# Altium project Modelo levitador magnético.PrjPcb
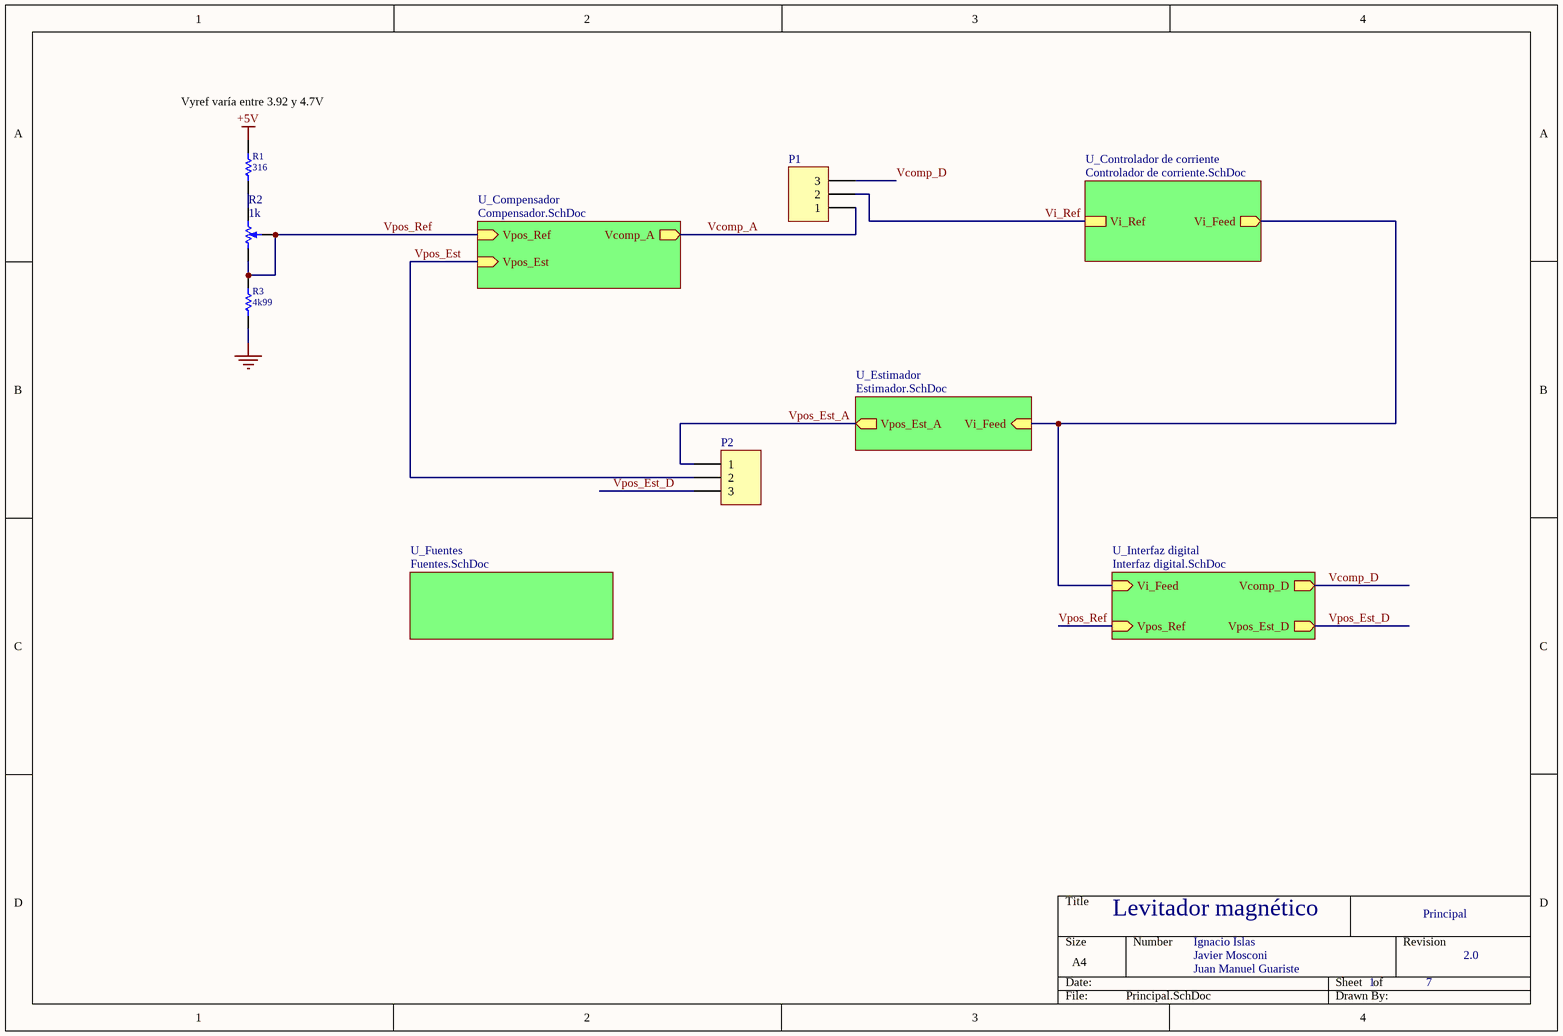
[diagram p0: Principal.SchDoc]
7 sheets, 249 parts. Net scope: hierarchical (ports join the sheet entries above them; power ports are global).
Board file: Levitador Magnetico.PcbDoc
Sheets:
  Principal.SchDoc
    U_Estimador = Estimador.SchDoc
    U_Compensador = Compensador.SchDoc
    U_Fuentes = Fuentes.SchDoc
    U_Interfaz digital = Interfaz digital.SchDoc
    U_Controlador de corriente = Controlador de corriente.SchDoc
      U_Puente H = Puente H.SchDoc

## Sheet Principal.SchDoc: Levitador magnético
size A4; Date: 27/10/2020; DocumentNumber: 1; SheetNumber: 1; SheetTotal: 7

### Parts
P1  Header 3  [HDR1X3]  (value not drawn)
P2  Header 3  [HDR1X3]  (value not drawn)
R1  316  [R1206]
R2  value 1k  [pote_5_pines_vertical]  (hidden comment: Potenciometro)
R3  4k99  [R1206]

### Sub-sheets
U_Compensador = Compensador.SchDoc: Vcomp_A (out), Vpos_Est (in), Vpos_Ref (in)
U_Controlador de corriente = Controlador de corriente.SchDoc: Vi_Ref, Vi_Feed (out)
U_Estimador = Estimador.SchDoc: Vi_Feed (in), Vpos_Est_A (out)
U_Fuentes = Fuentes.SchDoc: no entries
U_Interfaz digital = Interfaz digital.SchDoc: Vi_Feed (in), Vpos_Ref (in), Vcomp_D (out), Vpos_Est_D (out)

### Nets
+5V: R1.2
GND: R3.1
Vcomp_A: P1.1 ; sheet U_Compensador/Vcomp_A
Vcomp_D: P1.3 ; sheet U_Interfaz digital/Vcomp_D
Vi_Feed: sheet U_Estimador/Vi_Feed, sheet U_Interfaz digital/Vi_Feed, sheet U_Controlador de corriente/Vi_Feed
Vi_Ref: P1.2 ; sheet U_Controlador de corriente/Vi_Ref
Vpos_Est: P2.2 ; sheet U_Compensador/Vpos_Est
Vpos_Est_A: P2.1 ; sheet U_Estimador/Vpos_Est_A
Vpos_Est_D: P2.3 ; sheet U_Interfaz digital/Vpos_Est_D
Vpos_Ref: R2.2(W) R2.3(-) R3.2 ; sheet U_Compensador/Vpos_Ref, sheet U_Interfaz digital/Vpos_Ref
NetR1_1: R1.1 R2.1(+)

### Notes on the sheet
- (near R1) Vyref varía entre 3.92 y 4.7V
- Principal
- Ignacio Islas
- Javier Mosconi
- Juan Manuel Guariste
- 2.0

### Library data of the parts
P1 P2 = Header 3: TERM BLK 3P SIDE ENT 2.54MM PCB; Manufacturer: TE Connectivity AMP Connectors; Mfr PN: 282834-3; Class: Connector; Link: https://www.digikey.com/en/products/detail/te-connectivity-amp-connectors/282834-3/1153264; Supplier 1 PN: A98334-ND; Supplier 1: Digi-Key; Supplier 2: Mouser; Supplier 2 PN: 571-2828343
R1 = R1206: RES 316 OHM 1% 1/4W 1206; Manufacturer: Stackpole Electronics Inc; Mfr PN: RMCF1206FT316R; LatestRevisionDate: 29/7/2021; PackageReference: 1206; PackageDescription: SMT Chip Resistor; Supplier 1: Digi-Key; Value: 316; Tolerance: 1%; Supplier 1 PN: RMCF1206FT316RCT-ND
R2 = Potenciometro: POT 1K OHM 0.08W CARBON LINEAR; Manufacturer: Bourns Inc.; Mfr PN: PDB12-H4251-102BF; Supplier 1: Digi-Key; Supplier 1 PN: PDB12-H4251-102BF-ND
R3 = R1206: RES 4.99K OHM 1% 1/4W 1206; Manufacturer: Stackpole Electronics Inc; Mfr PN: RMCF1206FT4K99; LatestRevisionDate: 29/7/2021; PackageReference: 1206; PackageDescription: SMT Chip Resistor; Supplier 1: Digi-Key; Value: 4k99; Tolerance: 1%; Supplier 1 PN: RMCF1206FT4K99CT-ND

## Sheet Estimador.SchDoc
size A4; DocumentNumber: 5; SheetNumber: 5; SheetTotal: 7
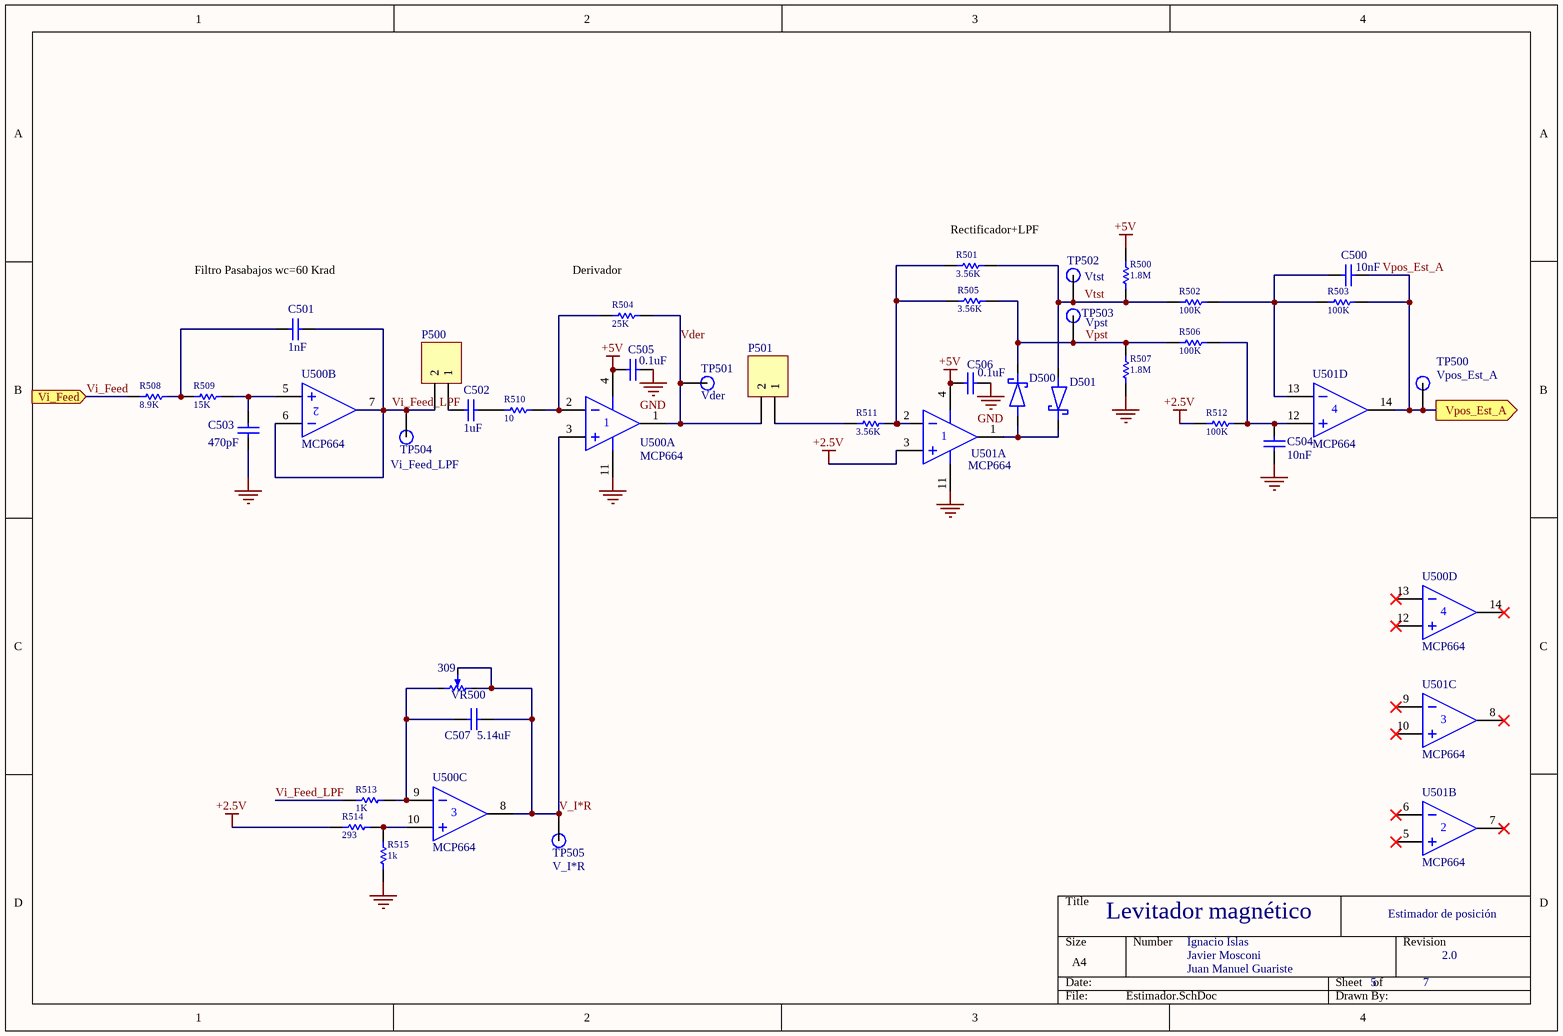
[diagram p1: Estimador.SchDoc]

### Parts
C500  value 10nF  [C1206]  (hidden comment: Capacitor)
C501  value 1nF  [C1206]  (hidden comment: Capacitor)
C502  value 1uF  [C1206]  (hidden comment: Capacitor)
C503  value 470pF  [C1206]  (hidden comment: Capacitor)
C504  value 10nF  [C1206]  (hidden comment: Capacitor)
C505  value 0.1uF  [C1206]  (hidden comment: Capacitor)
C506  value 0.1uF  [C1206]  (hidden comment: Capacitor)
C507  value 5.14uF  [C1206]  (hidden comment: Capacitor)
D500  RSX205LAM30TR  [SODFL4725X105N]  (value not drawn)
D501  RSX205LAM30TR  [SODFL4725X105N]  (value not drawn)
P500  Header 2  [HDR1X2]  (value not drawn)
P501  Header 2  [HDR1X2]  (value not drawn)
R500  1.8M  [R1206]
R501  3.56K  [R1206]
R502  100K  [R1206]
R503  100K  [R1206]
R504  25K  [R1206]
R505  3.56K  [R1206]
R506  100K  [R1206]
R507  1.8M  [R1206]
R508  8.9K  [R1206]
R509  15K  [R1206]
R510  10  [R1206]
R511  3.56K  [R1206]
R512  100K  [R1206]
R513  1K  [R1206]
R514  293  [R1206]
R515  1k  [R1206]
TP500  Vpos_Est_A  [TestPoint Keystone 5000 Silver-Red]
TP501  Vder  [TestPoint Keystone 5000 Silver-Red]
TP502  Vtst  [TestPoint Keystone 5000 Silver-Red]
TP503  Vpst  [TestPoint Keystone 5000 Silver-Red]
TP504  Vi_Feed_LPF  [TestPoint Keystone 5000 Silver-Red]
TP505  V_I*R  [TestPoint Keystone 5000 Silver-Red]
U500  MCP664  [SOIC14]  (parts A,B,C,D of 4)
U501  MCP664  [SOIC14]  (parts A,B,C,D of 4)
VR500  value 309  [3299Y1203LF]  (hidden comment: Trimmer (Thru-Hole))

### Ports
Vi_Feed (in), Vpos_Est_A (out)

### Nets
+2.5V: R512.2 R514.1 U501.3(IN+)
+5V: C505.1 C506.1 R500.2 U500.4(V+) U501.4(V+)
GND: C503.2 C504.1 C505.2 C506.2 R507.1 R515.1 U500.11(V-) U501.11(V-)
V_I*R: C507.1 TP505.1 U500.3(IN+) U500.8(OUT) VR500.2(W) VR500.3(CW)
Vder: P501.2 R504.2 TP501.1 U500.1(OUT)
Vi_Feed: R508.1 ; port Vi_Feed
Vi_Feed_LPF: C501.1 P500.2 R513.1 TP504.1 U500.6(IN-) U500.7(OUT)
Vpos_Est_A: C500.1 R503.1 TP500.1 U501.14(OUT) ; port Vpos_Est_A
Vpst: D500.1(K) R505.2 R506.1 R507.2 TP503.1
Vtst: D501.2(A) R500.1 R501.2 R502.1 TP502.1
NetC500_2: C500.2 R502.2 R503.2 U501.13(IN-)
NetC501_2: C501.2 R508.2 R509.1
NetC502_1: C502.1 P500.1
NetC502_2: C502.2 R510.1
NetC503_1: C503.1 R509.2 U500.5(IN+)
NetC504_2: C504.2 R506.2 R512.1 U501.12(IN+)
NetC507_2: C507.2 R513.2 U500.9(IN-) VR500.1(CCW)
NetD500_2: D500.2(A) D501.1(K) U501.1(OUT)
NetP501_1: P501.1 R511.1
NetR501_1: R501.1 R505.1 R511.2 U501.2(IN-)
NetR504_1: R504.1 R510.2 U500.2(IN-)
NetR514_2: R514.2 R515.2 U500.10(IN+)

Not connected (* = marked no-connect by the designer): U500 12(IN+)* 13(IN-)* 14(OUT)*; U501 5(IN+)* 6(IN-)* 7(OUT)* 8(OUT)* 9(IN-)* 10(IN+)*

### Notes on the sheet
- (near R501) Rectificador+LPF
- (near C501) Filtro Pasabajos wc=60 Krad
- (near R504) Derivador
- Levitador magnético
- Estimador de posición
- Ignacio Islas
- Javier Mosconi
- Juan Manuel Guariste
- 2.0

### Library data of the parts
C500 C504 = Capacitor: CAP CER 10000PF 500V X7R 1206; Manufacturer: KEMET; Mfr PN: C1206C103KCRAC7800; Supplier 1: Digi-Key; Supplier 1 PN: 399-C1206C103KCRAC7800CT-ND
C501 = Capacitor: CAP CER 1000PF 2KV X7R 1206; Mfr PN: 202R18W102KV4E; Manufacturer: Johanson Dielectrics Inc.; Supplier 1: Digi-Key; Supplier 1 PN: 709-1036-1-ND
C502 = Capacitor: CAP CER 1UF 25V X7R 1206; Manufacturer: CAL-CHIP ELECTRONICS, INC.; Mfr PN: GMC31X7R105M25NT; Supplier 1: Digi-Key; Supplier 1 PN: 2571-GMC31X7R105M25NTTR-ND
C503 = Capacitor: CAP CER 470PF 1KV C0G/NP0 1206; Manufacturer: Samsung Electro-Mechanics; Mfr PN: CL31C471JIHNNNE; Supplier 1: Digi-Key; Supplier 1 PN: 1276-3279-1-ND
C505 C506 = Capacitor: CAP CER 0.1UF 50V X7R 1206; Mfr PN: C1206X7R500-104KNE; Manufacturer: Venkel; Supplier 1: Digi-Key; Supplier 1 PN: 2679-C1206X7R500-104KNETR-ND
C507 = Capacitor: CAP CER 5100PF 100V NP0 5% 1206; Mfr PN: C1206C512J1GAC7800; Manufacturer: KEMET; Supplier 1: Digi-Key; Supplier 1 PN: 399-16393-1-ND
D500 D501 = RSX205LAM30TR: DIODE SCHOTTKY 30V 2A PMDTM; Manufacturer: ROHM Semiconductor; Mfr PN: RSX205LAM30TR; Supplier 1: Digi-Key; Supplier 1 PN: RSX205LAM30CT-ND
P500 P501 = Header 2: TERM BLK 2P SIDE ENT 2.54MM PCB; Manufacturer: TE Connectivity AMP Connectors; Mfr PN: 282834-2; Link: https://www.digikey.com/en/products/detail/te-connectivity-amp-connectors/282834-2/1150135; Supplier 1: Digi-Key; Supplier 1 PN: A98333-ND
R500 R507 = R1206: RES 1.8M OHM 1% 1/4W 1206; Mfr PN: RC1206FR-071M8L; Manufacturer: YAGEO; Supplier 1 PN: 311-1.80MFRCT-ND; Supplier 1: Digi-Key; Value: 1.8M; Tolerance: 1%
R501 R505 R511 = R1206: RES 3.57K OHM 1% 1/4W 1206; Mfr PN: RC1206FR-073K57L; Manufacturer: YAGEO; Supplier 1 PN: 311-3.57KFRCT-ND; Supplier 1: Digi-Key; Value: 3.56K; Tolerance: 1%
R502 R503 R506 R512 = R1206: RES 100K OHM 1% 1/4W 1206; Mfr PN: RMCF1206FT100K; Manufacturer: Stackpole Electronics Inc; Supplier 1 PN: RMCF1206FT100KCT-ND; Supplier 1: Digi-Key; Value: 100K; Tolerance: 1%
R504 = R1206: RES SMD 25K OHM 1% 1/4W 1206; Mfr PN: Y163025K0000F0W; Manufacturer: Vishay Foil Resistors (Division of Vishay Precision Group); PackageReference: 1206; Supplier 1 PN: Y163025K0000F0W-ND; Supplier 1: Digi-Key; Value: 25K; Tolerance: 1%
R508 = R1206: RES 8.87K OHM 1% 1/4W 1206; Mfr PN: RC1206FR-078K87L; Manufacturer: YAGEO; PackageReference: 1206; Supplier 1 PN: 311-8.87KFRCT-ND; Supplier 1: Digi-Key; Value: 8.9K; Tolerance: 1%
R509 = R1206: RES 15K OHM 1% 1/4W 1206; Mfr PN: CRCW120615K0FKEAC; Manufacturer: Vishay Dale; Supplier 1 PN: 541-CRCW120615K0FKEACCT-ND; PackageReference: 1206; Supplier 1: Digi-Key; Value: 15K; Tolerance: 1%
R510 = R1206: RES 10 OHM 1% 1/4W 1206; Mfr PN: RMCF1206FT10R0; Manufacturer: Stackpole Electronics Inc; Supplier 1 PN: RMCF1206FT10R0CT-ND; Supplier 1: Digi-Key; Value: 10; Tolerance: 1%
R513 R515 = R1206: RES 1K OHM 1% 1/4W 1206; Mfr PN: RMCF1206FT1K00; Manufacturer: Stackpole Electronics Inc; Supplier 1 PN: RMCF1206FT1K00CT-ND; Supplier 1: Digi-Key; Tolerance: 1%
  R513: Value: 1K
  R515: Value: 1k
R514 = R1206: RES SMD 294 OHM 1% 1/4W 1206; Mfr PN: CRCW1206294RFKEA; Manufacturer: Vishay Dale; Supplier 1 PN: 541-294FCT-ND; Supplier 1: Digi-Key; Tolerance: 1%; Value: 293
TP500-TP505 = Testpoint: PC TEST POINT MINIATURE RED; Manufacturer: Keystone Electronics; Mfr PN: 5000; Link: https://www.digikey.com/en/products/detail/keystone-electronics/5000/255326; Supplier 1: Digi-Key; Supplier 1 PN: 36-5000-ND
U500 U501 = MCP664: IC OPAMP GP 4 CIRCUIT 14TSSOP; Mfr PN: MCP664-E/ST; Manufacturer: Microchip Technology; Datasheet: https://ar.mouser.com/datasheet/2/268/20002194E-2448650.pdf; Supplier 1: Digi-Key; Supplier 1 PN: MCP664-E/ST-ND
VR500 = Trimmer: TRIMMER 500 OHM 0.5W PC PIN TOP; Mfr PN: 3299Y-1-501LF; Manufacturer: Bourns Inc.; Supplier 1: Digi-Key; Supplier 1 PN: 3299Y-501LF-ND

## Sheet Compensador.SchDoc
size A4; DocumentNumber: 4; SheetNumber: 4; SheetTotal: 7
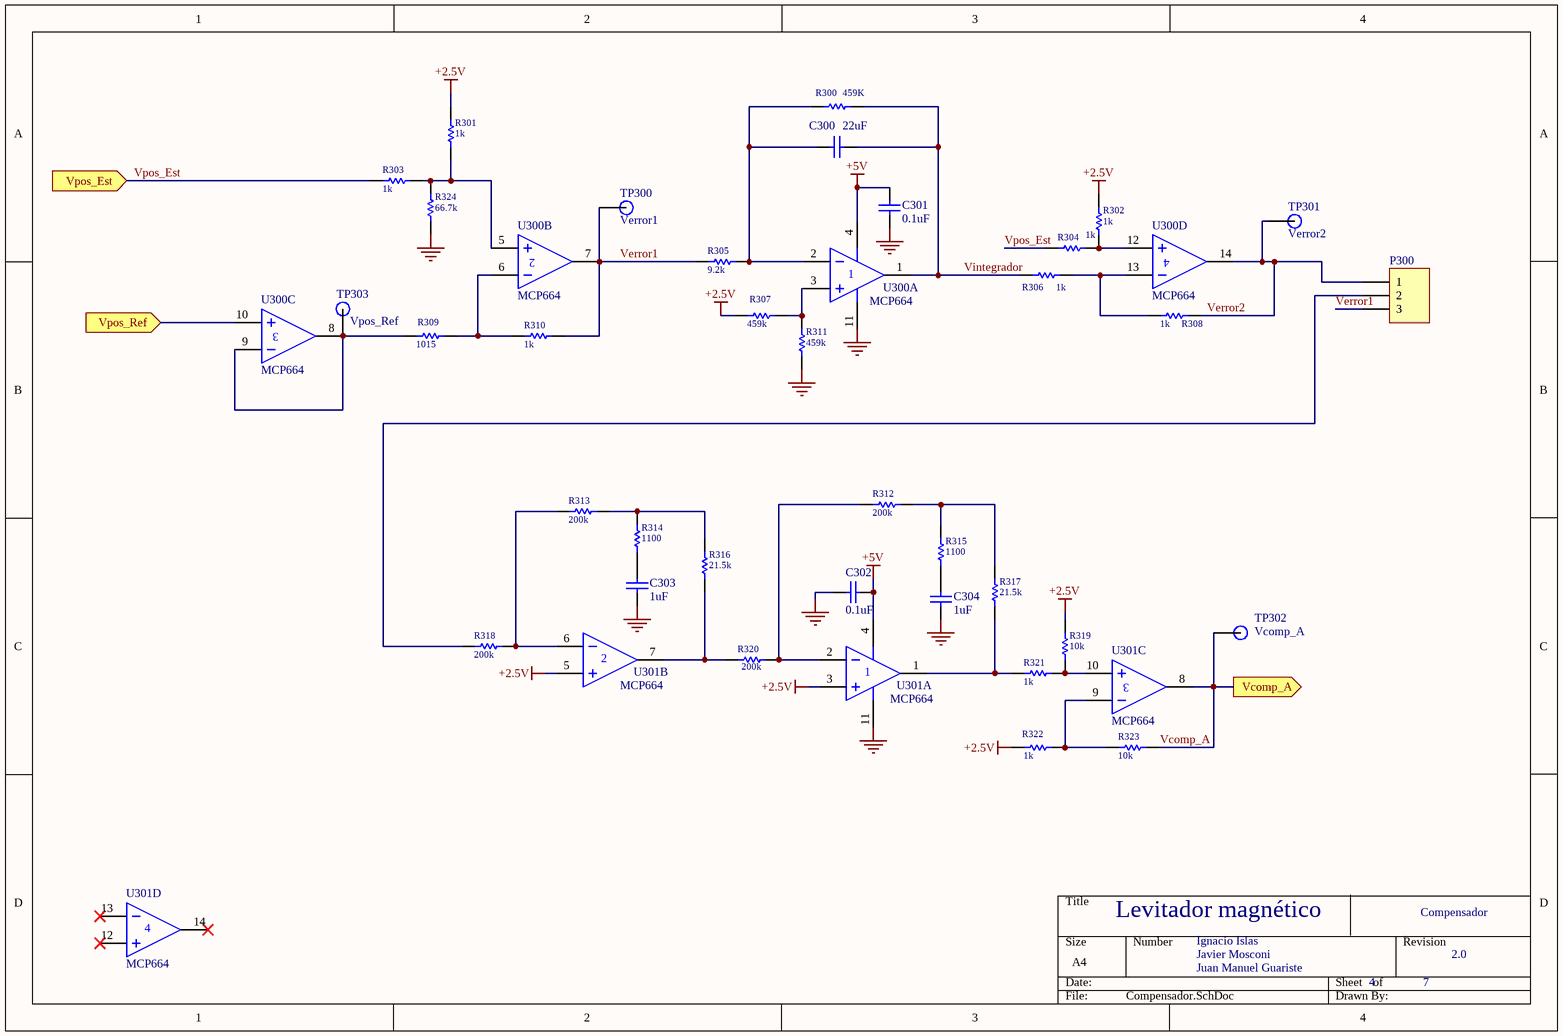
[diagram p2: Compensador.SchDoc]

### Parts
C300  value 22uF  [C1206]  (hidden comment: Capacitor)
C301  value 0.1uF  [C1206]  (hidden comment: Capacitor)
C302  value 0.1uF  [C1206]  (hidden comment: Capacitor)
C303  value 1uF  [C1206]  (hidden comment: Capacitor)
C304  value 1uF  [C1206]  (hidden comment: Capacitor)
P300  Header 3  [HDR1X3]  (value not drawn)
R300  459K  [R1206]
R301  1k  [R1206]
R302  1k  [R1206]
R303  1k  [R1206]
R304  1k  [R1206]
R305  9.2k  [R1206]
R306  1k  [R1206]
R307  459k  [R1206]
R308  1k  [R1206]
R309  1015  [R1206]
R310  1k  [R1206]
R311  459k  [R1206]
R312  200k  [R1206]
R313  200k  [R1206]
R314  1100  [R1206]
R315  1100  [R1206]
R316  21.5k  [R1206]
R317  21.5k  [R1206]
R318  200k  [R1206]
R319  10k  [R1206]
R320  200k  [R1206]
R321  1k  [R1206]
R322  1k  [R1206]
R323  10k  [R1206]
R324  66.7k  [R1206]
TP300  Verror1  [TestPoint Keystone 5000 Silver-Red]
TP301  Verror2  [TestPoint Keystone 5000 Silver-Red]
TP302  Vcomp_A  [TestPoint Keystone 5000 Silver-Red]
TP303  Vpos_Ref  [TestPoint Keystone 5000 Silver-Red]
U300  MCP664  [SOIC14]  (parts A,B,C,D of 4)
U301  MCP664  [SOIC14]  (parts A,B,C,D of 4)

### Ports
Vcomp_A (out), Vpos_Est (in), Vpos_Ref (in)

### Nets
+2.5V: R301.2 R302.2 R307.1 R319.2 R322.1 U301.3(IN+) U301.5(IN+)
+5V: C301.2 C302.2 U300.4(V+) U301.4(V+)
GND: C301.1 C302.1 C303.2 C304.1 R311.1 R324.2 U300.11(V-) U301.11(V-)
Vcomp_A: R323.2 TP302.1 U301.8(OUT) ; port Vcomp_A
Verror1: P300.3 R305.1 R310.2 TP300.1 U300.7(OUT)
Verror2: P300.1 R308.2 TP301.1 U300.14(OUT)
Vintegrador: C300.1 R300.2 R306.1 U300.1(OUT)
Vpos_Est: R303.1 R304.1 ; port Vpos_Est
Vpos_Ref: U300.10(IN+) ; port Vpos_Ref
NetC300_2: C300.2 R300.1 R305.2 U300.2(IN-)
NetC303_1: C303.1 R314.1
NetC304_2: C304.2 R315.1
NetP300_2: P300.2 R318.1
NetR301_1: R301.1 R303.2 R324.1 U300.5(IN+)
NetR302_1: R302.1 R304.2 U300.12(IN+)
NetR306_2: R306.2 R308.1 U300.13(IN-)
NetR307_2: R307.2 R311.2 U300.3(IN+)
NetR309_1: R309.1 TP303.1 U300.8(OUT) U300.9(IN-)
NetR309_2: R309.2 R310.1 U300.6(IN-)
NetR312_1: R312.1 R320.2 U301.2(IN-)
NetR312_2: R312.2 R315.2 R317.2
NetR313_1: R313.1 R318.2 U301.6(IN-)
NetR313_2: R313.2 R314.2 R316.2
NetR316_1: R316.1 R320.1 U301.7(OUT)
NetR317_1: R317.1 R321.1 U301.1(OUT)
NetR319_1: R319.1 R321.2 U301.10(IN+)
NetR322_2: R322.2 R323.1 U301.9(IN-)

Not connected (* = marked no-connect by the designer): U301 12(IN+)* 13(IN-)* 14(OUT)*

### Notes on the sheet
- Levitador magnético
- Compensador
- Ignacio Islas
- Javier Mosconi
- Juan Manuel Guariste
- 2.0

### Library data of the parts
C300 = Capacitor: CAP CER 22UF 16V X5R 1206; Manufacturer: Samsung Electro-Mechanics; Mfr PN: CL31A226MOCLNNC; Supplier 1 PN: 1276-2728-1-ND; Supplier 1: Digi-Key
C301 C302 = Capacitor: CAP CER 0.1UF 50V X7R 1206; Manufacturer: Venkel; Mfr PN: C1206X7R500-104KNE; Supplier 1: Digi-Key; Supplier 1 PN: 2679-C1206X7R500-104KNETR-ND
C303 C304 = Capacitor: CAP CER 1UF 25V X7R 1206; Manufacturer: CAL-CHIP ELECTRONICS, INC.; Mfr PN: GMC31X7R105M25NT; Supllier 1: Digi-Key; Supplier 1 PN: 2571-GMC31X7R105M25NTTR-ND
P300 = Header 3: TERM BLK 3P SIDE ENT 2.54MM PCB; Manufacturer: TE Connectivity AMP Connectors; Mfr PN: 282834-3; Link: https://www.digikey.com/en/products/detail/te-connectivity-amp-connectors/282834-3/1153264; Supplier 1 PN: A98334-ND; Supplier 1: Digi-Key
R300 R307 = R1206: RES 459K OHM 1% 1/4W 1206; Manufacturer: KOA Speer Electronics, Inc.; Mfr PN: RN73H2BTTD4593F10; PackageReference: 1206; Supplier 1: Digi-Key; Tolerance: 1%; Supplier 1 PN: 2019-RN73H2BTTD4593F10CT-ND
  R300: Value: 459K
  R307: Value: 459k
R301-R303 R306 R308 R310 R321 R322 = R1206: RES 1K OHM 1% 1/4W 1206; Manufacturer: Stackpole Electronics Inc; Mfr PN: RMCF1206FT1K00; Supplier 1: Digi-Key; Value: 1k; Tolerance: 1%; Supplier 1 PN: RMCF1206FT1K00CT-ND
  R301: PackageReference: 1206; PackageDescription: SMT Chip Resistor
  R303 R306 R308 R310 R321 R322: PackageReference: 1206
R304 = R1206: as R513 on sheet Estimador; Supplier 1 PN: RMCF1206FT1K00CT-ND; Supplier 1: Digi-Key; Value: 1k; Tolerance: 1%
R305 R311 = R1206: RES 9.2K OHM 1% 1/4W 1206; Manufacturer: KOA Speer Electronics, Inc.; Mfr PN: RN73H2BTTD9201F10; PackageReference: 1206; Supplier 1: Digi-Key; Tolerance: 1%; Supplier 1 PN: 2019-RN73H2BTTD9201F10CT-ND
  R305: Value: 9.2k
  R311: Value: 459k
R309 = R1206: RES 1.01K OHM 0.1% 1/3W 1206; Manufacturer: Stackpole Electronics Inc; Mfr PN: RNCF1206BTE1K01; Tolerance: 1%; Supplier 1: Digi-Key; Value: 1015; Supplier 1 PN: RNCF1206BTE1K01
R312 R313 R318 R320 = R1206: RES 200K OHM 1% 1/4W 1206; Manufacturer: YAGEO; Mfr PN: RC1206FR-07200KL; PackageReference: 1206; Supplier 1: Digi-Key; Value: 200k; Tolerance: 1%; Supplier 1 PN: 311-200KFRCT-ND
R314 R315 = R1206: RES 1.1K OHM 1% 1/4W 1206; Manufacturer: YAGEO; Mfr PN: RC1206FR-071K1L; PackageReference: 1206; Supplier 1: Digi-Key; Value: 1100; Tolerance: 1%; Supplier 1 PN: 311-1.10KFRCT-ND
R316 R317 = R1206: RES 21.5K OHM 1% 1/4W 1206; Manufacturer: YAGEO; Mfr PN: RC1206FR-0721K5L; PackageReference: 1206; Supplier 1: Digi-Key; Value: 21.5k; Tolerance: 1%; Supplier 1 PN: 311-21.5KFRCT-ND
R319 R323 = R1206: RES 10K OHM 1% 1/4W 1206; Manufacturer: YAGEO; Mfr PN: RC1206FR-0710KL; PackageReference: 1206; Supplier 1: Digi-Key; Value: 10k; Tolerance: 1%; Supplier 1 PN: 311-10.0KFRCT-ND
R324 = R1206: RES 1K OHM 1% 1/4W 1206; Manufacturer: YAGEO; Mfr PN: RC1206FR-0766K5L; PackageReference: 1206; PackageDescription: SMT Chip Resistor; Supplier 1: Digi-Key; Value: 66.7k; Tolerance: 1%; Supplier 1 PN: 311-66.5KFRCT-ND
TP300-TP303 = Testpoint: as TP500 on sheet Estimador; Link: https://www.digikey.com/en/products/detail/keystone-electronics/5000/255326; Supplier 1: Digi-Key; Supplier 1 PN: 36-5000-ND
U300 U301 = MCP664: as U500 on sheet Estimador; Datasheet: https://ar.mouser.com/datasheet/2/268/20002194E-2448650.pdf; Supplier 1 PN: MCP664-E/ST-ND; Supplier 1: Digi-Key

## Sheet Fuentes.SchDoc
size A4; DocumentNumber: 7; SheetNumber: 7; SheetTotal: 7
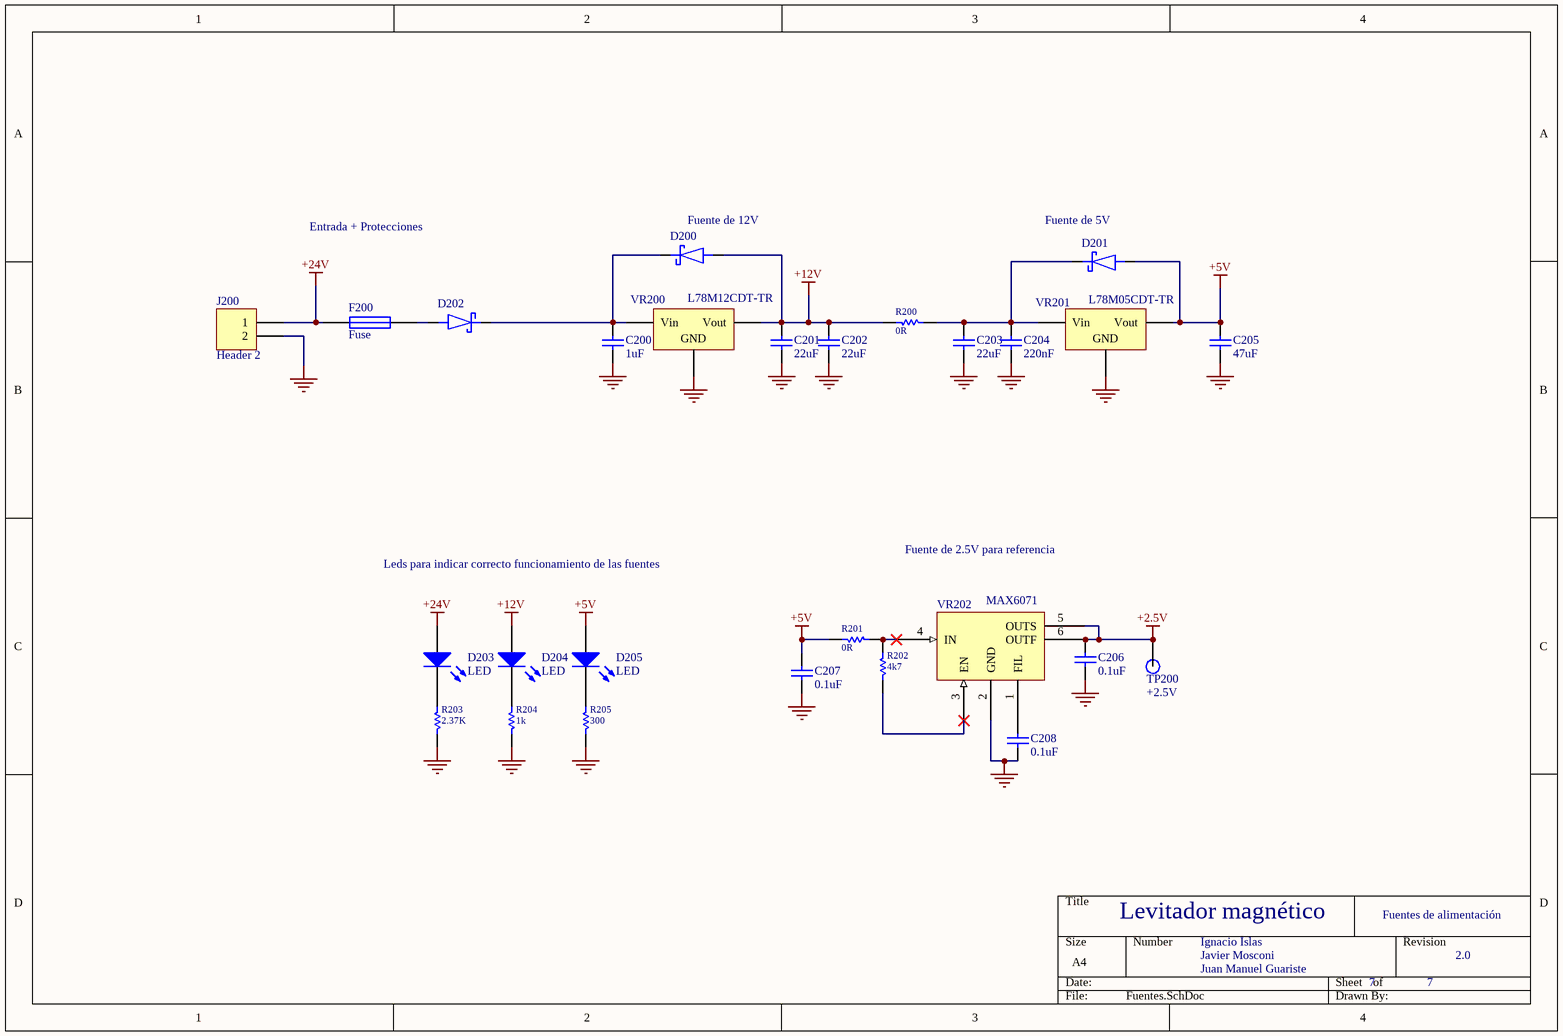
[diagram p3: Fuentes.SchDoc]

### Parts
C200  value 1uF  [C1206]  (hidden comment: Capacitor)
C201  value 22uF  [C1206]  (hidden comment: Capacitor)
C202  value 22uF  [C1206]  (hidden comment: Capacitor)
C203  value 22uF  [C1206]  (hidden comment: Capacitor)
C204  value 220nF  [C1206]  (hidden comment: Capacitor)
C205  value 47uF  [C1206]  (hidden comment: Capacitor)
C206  value 0.1uF  [C1206]  (hidden comment: Capacitor)
C207  value 0.1uF  [C1206]  (hidden comment: Capacitor)
C208  value 0.1uF  [C1206]  (hidden comment: Capacitor)
D200  RSX205LAM30TR  [SODFL4725X105N]  (value not drawn)
D201  RSX205LAM30TR  [SODFL4725X105N]  (value not drawn)
D202  RSX205LAM30TR  [SODFL4725X105N]  (value not drawn)
D203  LED  [LED 1206 RED]
D204  LED  [LED 1206 RED]
D205  LED  [LED 1206 RED]
F200  Fuse  [R1206]
J200  Header 2  [SMKDS5-2-9.5]
R200  0R  [R1206]
R201  0R  [R1206]
R202  4k7  [R1206]
R203  2.37K  [R1206]
R204  1k  [R1206]
R205  300  [R1206]
TP200  +2.5V  [TestPoint Keystone 5000 Silver-Red]
VR200  L78M12CDT-TR  [TO252-AA]
VR201  L78M05CDT-TR  [TO252-AA]
VR202  MAX6071  [SOT23-6]

### Nets
+2.5V: C206.2 TP200.1 VR202.5(OUTS) VR202.6(OUTF)
+5V: C205.2 C207.2 D201.2(A) D205.1(A) R201.2 VR201.3(Vout)
+12V: C201.2 C202.2 D200.2(A) D204.1(A) R200.2 VR200.3(Vout)
+24V: D203.1(A) F200.1 J200.1
GND: C200.1 C201.1 C202.1 C203.1 C204.1 C205.1 C206.1 C207.1 C208.1 J200.2 R203.1 R204.2 R205.1 VR200.2(GND) VR201.2(GND) VR202.2(GND)
NetC200_2: C200.2 D200.1(K) D202.1(K) VR200.1(Vin)
NetC203_2: C203.2 C204.2 D201.1(K) R200.1 VR201.1(Vin)
NetC208_2: C208.2 VR202.1(FIL)
NetD202_2: D202.2(A) F200.2
NetD203_2: D203.2(K) R203.2
NetD204_2: D204.2(K) R204.1
NetD205_2: D205.2(K) R205.2
NetR201_1: R201.1 R202.2 VR202.4(IN)
NetR202_1: R202.1 VR202.3(EN)

### Notes on the sheet
- Entrada + Protecciones
- (near D200) Fuente de 12V
- (near D201) Fuente de 5V
- Leds para indicar correcto funcionamiento de las fuentes
- Fuente de 2.5V para referencia
- Levitador magnético
- Fuentes de alimentación
- Ignacio Islas
- Javier Mosconi
- Juan Manuel Guariste
- 2.0

### Library data of the parts
C200 = Capacitor: as C502 on sheet Estimador; Supplier 1: Digi-Key; Supplier 1 PN: 2571-GMC31X7R105M25NTTR-ND
C201-C203 = Capacitor: as C300 on sheet Compensador; Supplier 1: Digi-Key; Supplier 1 PN: 1276-2728-1-ND
C204 = Capacitor: CAP CER 0.22UF 50V X7R 1206; Mfr PN: CL31B224KBFNNNE; Manufacturer: Samsung Electro-Mechanics; Supplier 1: Digi-Key; Supplier 1 PN: 1276-1106-1-ND
C205 = Capacitor: CAP CER 47UF 10V X5R 1206; Manufacturer: Taiyo Yuden; Mfr PN: LMK316BJ476ML-T; Supplier 1: Digi-Key; Supplier 1 PN: 587-1780-1-ND
C206 C208 = Capacitor: as C505 on sheet Estimador; Supplier 1: Digi-Key; Supplier 1 PN: 2679-C1206X7R500-104KNETR-ND
C207 = Capacitor: as C301 on sheet Compensador; Supplier 1: Digi-Key; Supplier 1 PN: 2679-C1206X7R500-104KNETR-ND
D200-D202 = RSX205LAM30TR: as D500 on sheet Estimador; Mfr PN: RSX205LAM30TR; Supplier 1 PN: RSX205LAM30CT-ND; Supplier 1: Digi-Key
D203-D205 = LED: 1206 RED SMD LED; Manufacturer: American Opto Plus LED; Mfr PN: L152L-LIC; Supplier 1: Digi-Key; Supplier 1 PN: 2460-L152L-LICTR-ND
F200 = Fuse: FUSE 500MA 125VAC FAST 1206; Mfr PN: C1F 500; Manufacturer: Bel Fuse Inc.; Supplier 1 PN: 507-1876-1-ND; Supplier 1: Digi-Key; Datasheet: https://belfuse.com/resources/datasheets/circuitprotection/ds-cp-c1f-series.pdf
J200 = Header 2: as P500 on sheet Estimador; Supplier 1: Digi-Key; Link: https://www.digikey.com/en/products/detail/te-connectivity-amp-connectors/282834-2/1150135; Supplier 1 PN: A98333-ND
R200 R201 = R1206: RES 0 OHM JUMPER 1/4W 1206; Mfr PN: RMCF1206ZT0R00; Manufacturer: Stackpole Electronics Inc; Supplier 1 PN: RMCF1206ZT0R00CT-ND; Supplier 1: Digi-Key; Value: 0R
R202 = R1206: RES 4.7K OHM 1% 1/4W 1206; Mfr PN: RMCF1206FT4K70; Manufacturer: Stackpole Electronics Inc; PackageReference: 1206; Supplier 1 PN: RMCF1206FT4K70CT-ND; Supplier 1: Digi-Key; Value: 4k7; Tolerance: 1%
R203 = R1206: RES 2.37K OHM 1% 1/4W 1206; Mfr PN: RMCF1206FG2K37; Manufacturer: Stackpole Electronics Inc; Supplier 1: Digi-Key; Value: 2.37K; Tolerance: 1%; Supplier 1 PN: RMCF1206FG2K37CT-ND
R204 = R1206: as R513 on sheet Estimador; Supplier 1 PN: RMCF1206FT1K00CT-ND; Supplier 1: Digi-Key; Value: 1k; Tolerance: 1%
R205 = R1206: RES 300 OHM 1% 1/4W 1206; Mfr PN: RC1206FR-10300RL; Manufacturer: YAGEO; Supplier 1 PN: 13-RC1206FR-10300RLCT-ND; Supplier 1: Digi-Key; Value: 300; Tolerance: 1%
TP200 = Testpoint: as TP500 on sheet Estimador; Link: https://www.digikey.com/en/products/detail/keystone-electronics/5000/255326; Supplier 1: Digi-Key; Supplier 1 PN: 36-5000-ND
VR200 = Volt Reg: Voltage Regulator; Manufacturer: STMicroelectronics; Supplier 1: Digi-Key; Mfr PN: L78M12CDT-TR; Supplier 1 PN: 497-1211-1-ND
VR201 = Volt Reg: IC REG LINEAR 5V 500MA DPAK; Manufacturer: STMicroelectronics; Supplier 1: Digi-Key; Mfr PN: L78M05CDT-TR; Supplier 1 PN: 497-1203-1-ND
VR202 = MAX6071: IC VREF SERIES 0.08% SOT23-6; Manufacturer: Analog Devices Inc./Maxim Integrated; Mfr PN: MAX6071BAUT41+T; Supplier 1: Digi-Key; Datasheet: https://ar.mouser.com/datasheet/2/256/MAX6070_MAX6071-217862.pdf; Supplier 1 PN: MAX6071BAUT41+TCT-ND

## Sheet Interfaz digital.SchDoc
size A4; DocumentNumber: 6; SheetNumber: 6; SheetTotal: 7
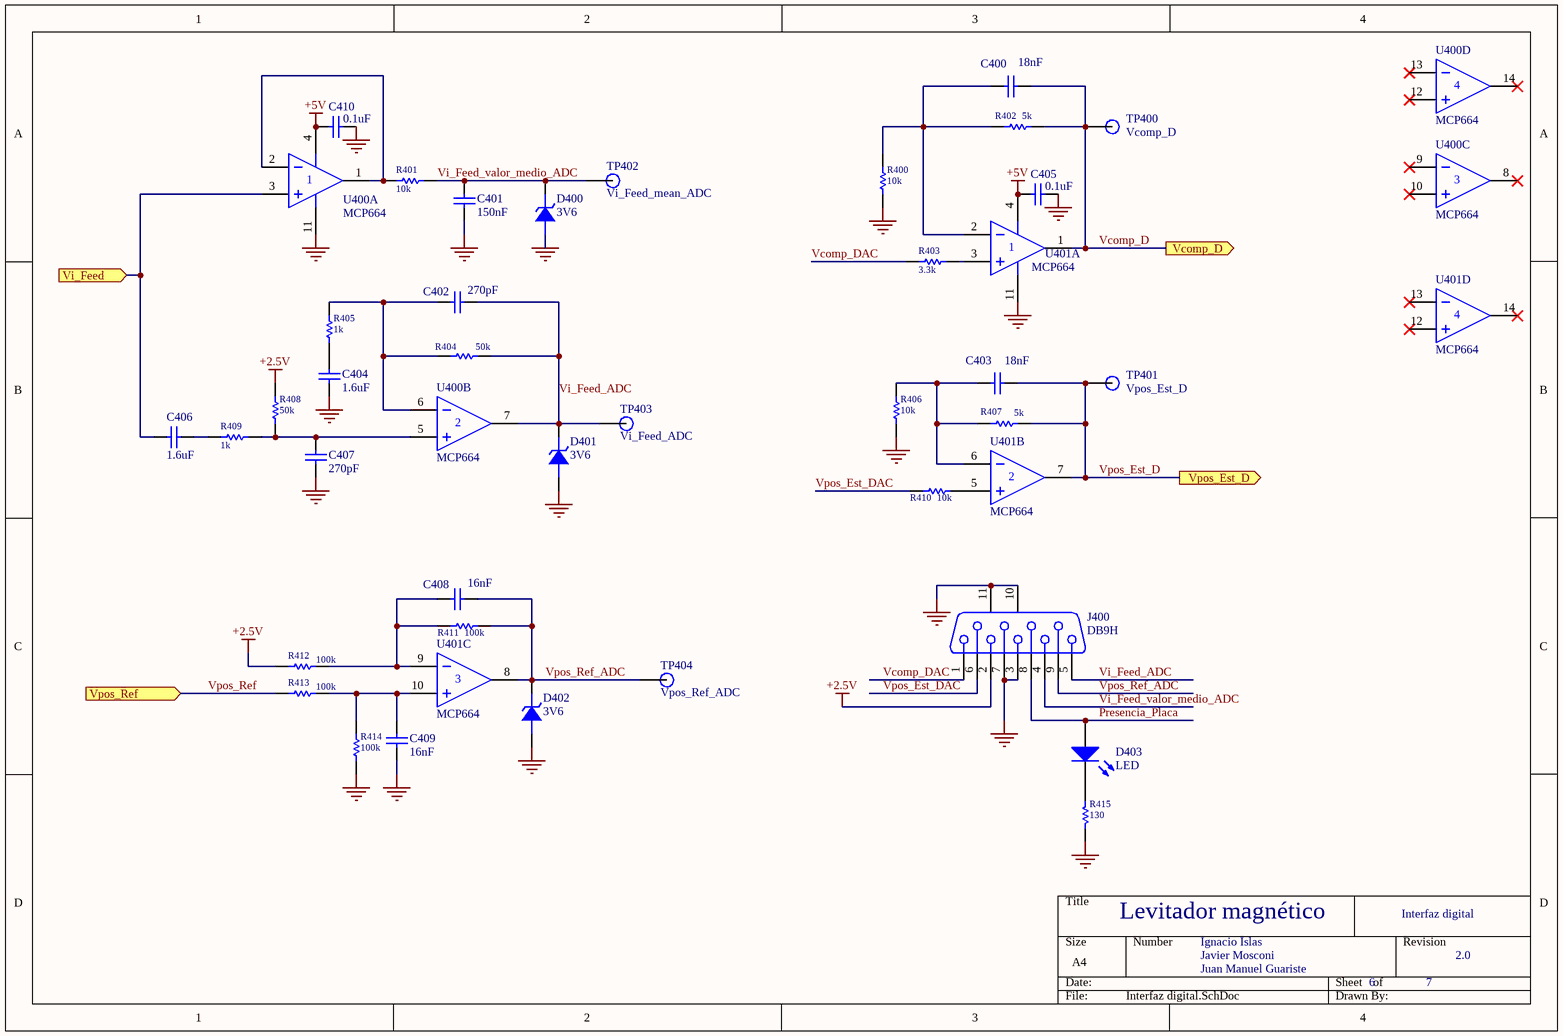
[diagram p4: Interfaz digital.SchDoc]

### Parts
C400  value 18nF  [C1206]  (hidden comment: Capacitor)
C401  value 150nF  [C1206]  (hidden comment: Capacitor)
C402  value 270pF  [C1206]  (hidden comment: Capacitor)
C403  value 18nF  [C1206]  (hidden comment: Capacitor)
C404  value 1.6uF  [C1206]  (hidden comment: Capacitor)
C405  value 0.1uF  [C1206]  (hidden comment: Capacitor)
C406  value 1.6uF  [C1206]  (hidden comment: Capacitor)
C407  value 270pF  [C1206]  (hidden comment: Capacitor)
C408  value 16nF  [C1206]  (hidden comment: Capacitor)
C409  value 16nF  [C1206]  (hidden comment: Capacitor)
C410  value 0.1uF  [C1206]  (hidden comment: Capacitor)
D400  value 3V6  [SMB]  (hidden comment: Diodo Zener)
D401  value 3V6  [SMB]  (hidden comment: Diodo Zener)
D402  value 3V6  [SMB]  (hidden comment: Diodo Zener)
D403  LED  [LED 1206 RED]
J400  DB9H  [DB9H]
R400  10k  [R1206]
R401  10k  [R1206]
R402  5k  [R1206]
R403  3.3k  [R1206]
R404  50k  [R1206]
R405  1k  [R1206]
R406  10k  [R1206]
R407  5k  [R1206]
R408  50k  [R1206]
R409  1k  [R1206]
R410  10k  [R1206]
R411  100k  [R1206]
R412  100k  [R1206]
R413  100k  [R1206]
R414  100k  [R1206]
R415  130  [R1206]
TP400  Vcomp_D  [TestPoint Keystone 5000 Silver-Red]
TP401  Vpos_Est_D  [TestPoint Keystone 5000 Silver-Red]
TP402  Vi_Feed_mean_ADC  [TestPoint Keystone 5000 Silver-Red]
TP403  Vi_Feed_ADC  [TestPoint Keystone 5000 Silver-Red]
TP404  Vpos_Ref_ADC  [TestPoint Keystone 5000 Silver-Red]
U400  MCP664  [SOIC14]  (parts A,B,C,D of 4)
U401  MCP664  [SOIC14]  (parts A,B,C,D of 4)

### Ports
Vcomp_D (out), Vi_Feed (in), Vpos_Est_D (out), Vpos_Ref (in)

### Nets
+2.5V: J400.2 R408.2 R412.1
+5V: C405.1 C410.1 U400.4(V+) U401.4(V+)
GND: C401.1 C404.2 C405.2 C407.1 C409.2 C410.2 D400.1 D401.1 D402.1 J400.3 J400.7 J400.10(MH1) J400.11(MH2) R400.1 R406.1 R414.1 R415.1 U400.11(V-) U401.11(V-)
Presencia_Placa: D403.1(A) J400.8
Vcomp_D: C400.1 R402.2 TP400.1 U401.1(OUT) ; port Vcomp_D
Vcomp_DAC: J400.1 R403.1
Vi_Feed: C406.1 U400.3(IN+) ; port Vi_Feed
Vi_Feed_ADC: C402.1 D401.2 J400.5 R404.2 TP403.1 U400.7(OUT)
Vi_Feed_valor_medio_ADC: C401.2 D400.2 J400.4 R401.2 TP402.1
Vpos_Est_D: C403.1 R407.2 TP401.1 U401.7(OUT) ; port Vpos_Est_D
Vpos_Est_DAC: J400.6 R410.1
Vpos_Ref: R413.1 ; port Vpos_Ref
Vpos_Ref_ADC: C408.1 D402.2 J400.9 R411.2 TP404.1 U401.8(OUT)
NetC400_2: C400.2 R400.2 R402.1 U401.2(IN-)
NetC402_2: C402.2 R404.1 R405.2 U400.6(IN-)
NetC403_2: C403.2 R406.2 R407.1 U401.6(IN-)
NetC404_1: C404.1 R405.1
NetC406_2: C406.2 R409.1
NetC407_2: C407.2 R408.1 R409.2 U400.5(IN+)
NetC408_2: C408.2 R411.1 R412.2 U401.9(IN-)
NetC409_1: C409.1 R413.2 R414.2 U401.10(IN+)
NetD403_2: D403.2(K) R415.2
NetR401_1: R401.1 U400.1(OUT) U400.2(IN-)
NetR403_2: R403.2 U401.3(IN+)
NetR410_2: R410.2 U401.5(IN+)

Not connected (* = marked no-connect by the designer): U400 8(OUT)* 9(IN-)* 10(IN+)* 12(IN+)* 13(IN-)* 14(OUT)*; U401 12(IN+)* 13(IN-)* 14(OUT)*

### Notes on the sheet
- Levitador magnético
- Interfaz digital
- Ignacio Islas
- Javier Mosconi
- Juan Manuel Guariste
- 2.0

### Library data of the parts
C400 C403 = Capacitor: CAP CER 0.018UF 100V X7R 1206; Mfr PN: C1206C183K1RAC7800; Manufacturer: KEMET; Supplier 1: Digi-Key; Supplier 1 PN: 399-C1206C183K1RAC7800CT-ND
C401 = Capacitor: CAP CER 0.15UF 50V X7R 1206; Mfr PN: 12065C154KAT2A; Manufacturer: KYOCERA AVX; Supplier 1: Digi-Key; Supplier 1 PN: 478-1558-1-ND
C402 C407 = Capacitor: CAP CER 270PF 50V C0G/NP0 1206; Mfr PN: C1206C271J5GAC7800; Manufacturer: KEMET; Supplier 1: Digi-Key; Supplier 1 PN: 399-14675-1-ND
C404 C406 = Capacitor: CAP CER 1.5UF 10V X7R 1206; Manufacturer: YAGEO; Mfr PN: CC1206KKX7R6BB155; Supplier 1: Digi-Key; Supplier 1 PN: 311-3452-1-ND
C405 C410 = Capacitor: as C505 on sheet Estimador; Supplier 1: Digi-Key; Supplier 1 PN: 2679-C1206X7R500-104KNETR-ND
C408 C409 = Capacitor: CAP CER 0.016UF 50V C0G/NP0 1206; Mfr PN: GRM3195C1H163JA01D; Manufacturer: Murata Electronics; Supplier 1: Digi-Key; Supplier 1 PN: 490-12760-1-ND
D400-D402 = Diodo Zener: DIODE ZENER 3.6V 3W SMB; Manufacturer: onsemi; Mfr PN: 1SMB5914BT3G; Supplier 1 PN: 1SMB5914BT3GOSCT-ND; Supplier 1: Digi-Key
D403 = LED: 1206 RED SMD LED; Manufacturer: American Opto Plus LED; Mfr PN: L152L-LIC; Sipplier 1 PN: Digi-Key; Supplier 1: 2460-L152L-LICTR-ND
J400 = DB9H: CONN D-SUB RCPT 9POS R/A SLDR; Manufacturer: Assmann WSW Components; Mfr PN: A-DF 09 A/KG-T4S; Supplier 1 PN: AE10924-ND; Supplier 1: Digi-Key
R400 R401 R406 R410 = R1206: RES 10K OHM 1% 1/4W 1206; Mfr PN: RC1206FR-0710KL; Manufacturer: YAGEO; PackageReference: 1206; Supplier 1 PN: 311-10.0KFRCT-ND; Supplier 1: Digi-Key; Value: 10k; Tolerance: 1%
R402 R407 = R1206: RES SMD 5K OHM 1% 0.3W 1206; Mfr PN: Y16255K00000F9W; Manufacturer: Vishay Foil Resistors (Division of Vishay Precision Group); PackageReference: 1206; Supplier 1 PN: Y16255K00000F9W-ND; Supplier 1: Digi-Key; Value: 5k; Tolerance: 1%
R403 = R1206: RES SMD 3.3K OHM 1% 3/4W 1206; Mfr PN: CRCW12063K30FKEAHP; Manufacturer: Vishay Dale; PackageReference: 1206; Supplier 1 PN: 541-3.30KUCT-ND; Supplier 1: Digi-Key; Value: 3.3k; Tolerance: 1%
R404 R408 = R1206: RES SMD 50K OHM 0.1% 1/4W 1206; Mfr PN: RT1206BRD0750KL; Manufacturer: YAGEO; Supplier 1 PN: 13-RT1206BRD0750KLCT-ND; PackageReference: 1206; Supplier 1: Digi-Key; Value: 50k; Tolerance: 0.1%
R405 R409 = R1206: as R513 on sheet Estimador; PackageReference: 1206; Supplier 1 PN: RMCF1206FT1K00CT-ND; Supplier 1: Digi-Key; Value: 1k; Tolerance: 1%
R411-R414 = R1206: as R502 on sheet Estimador; PackageReference: 1206; Supplier 1 PN: RMCF1206FT100KCT-ND; Supplier 1: Digi-Key; Value: 100k; Tolerance: 1%
R415 = R1206: RES 130 OHM 1% 1/4W 1206; Mfr PN: RMCF1206FT130R; Manufacturer: Stackpole Electronics Inc; Supplier 1: Digi-Key; Value: 130; Tolerance: 1%; Supplier 1 PN: RMCF1206FT130RCT-ND
TP400-TP404 = Testpoint: as TP500 on sheet Estimador; Link: https://www.digikey.com/en/products/detail/keystone-electronics/5000/255326; Supplier 1: Digi-Key; Supplier 1 PN: 36-5000-ND
U400 U401 = MCP664: as U500 on sheet Estimador; Datasheet: https://ar.mouser.com/datasheet/2/268/20002194E-2448650.pdf; Supplier 1: Digi-Key; Supplier 1 PN: MCP664-E/ST-ND

## Sheet Controlador de corriente.SchDoc: Levitador magnético
size A4; DocumentNumber: 2; SheetNumber: 2; SheetTotal: 7
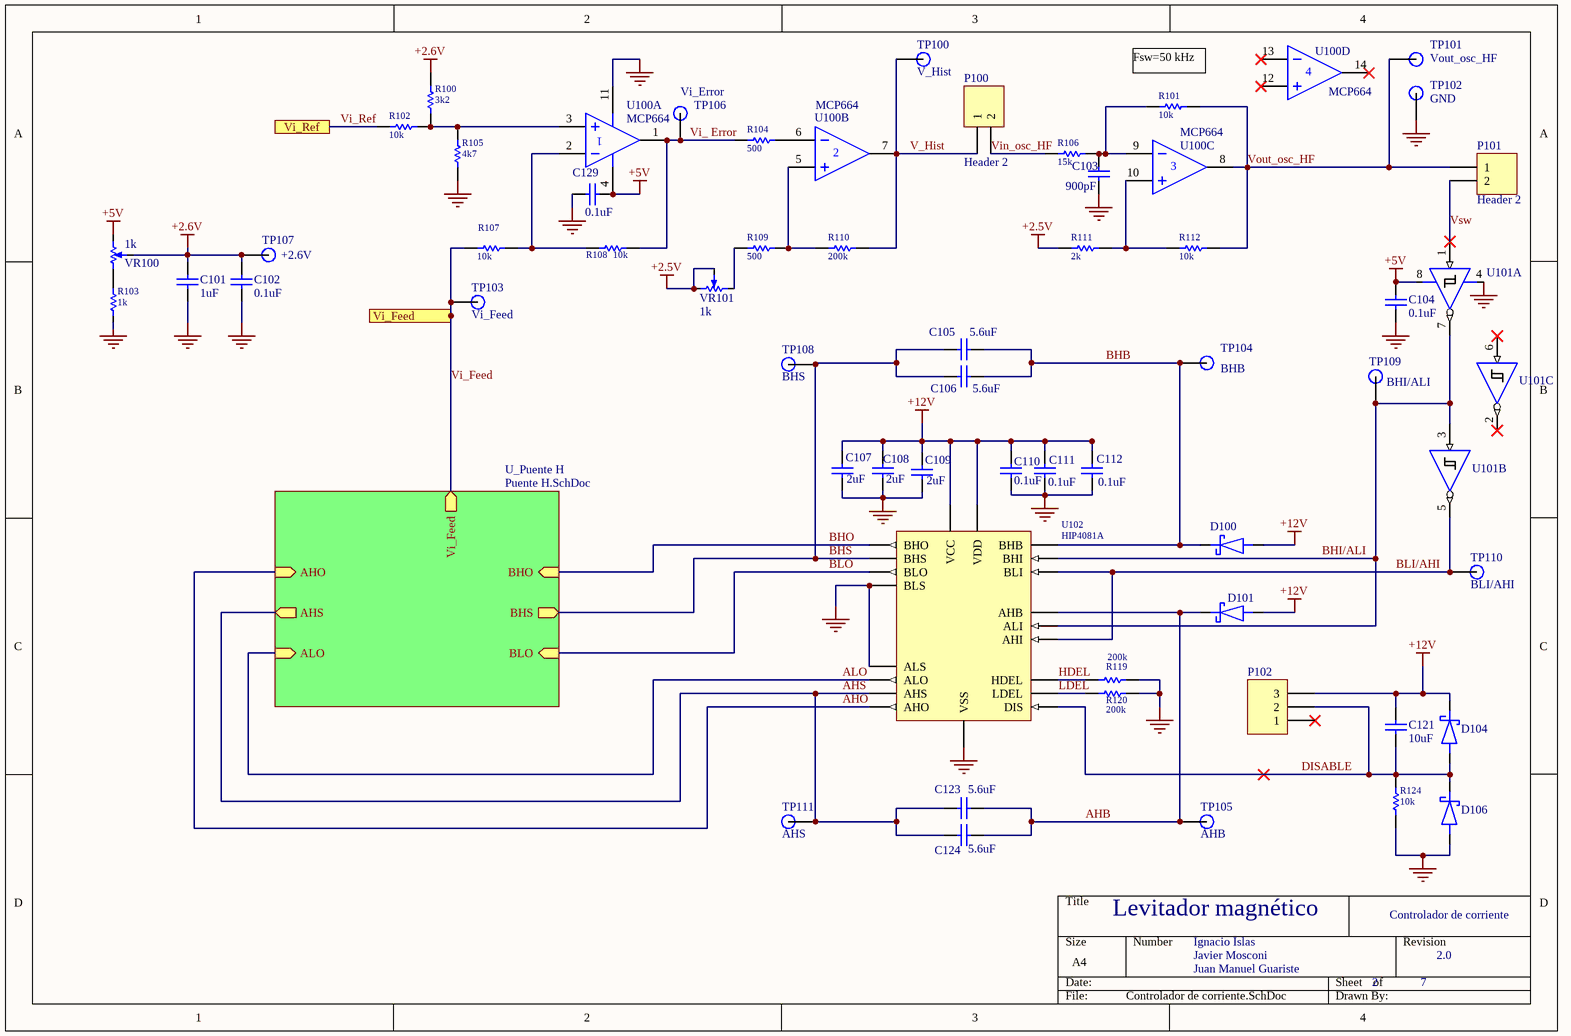
[diagram p5: Controlador de corriente.SchDoc]

### Parts
C101  value 1uF  [C1206]  (hidden comment: Capacitor)
C102  value 0.1uF  [C1206]  (hidden comment: Capacitor)
C103  value 900pF  [C1206]  (hidden comment: Capacitor)
C104  value 0.1uF  [C1206]  (hidden comment: Capacitor)
C105  value 5.6uF  [C1206]  (hidden comment: Capacitor)
C106  value 5.6uF  [C1206]  (hidden comment: Capacitor)
C107  value 2uF  [C1206]  (hidden comment: Capacitor)
C108  value 2uF  [C1206]  (hidden comment: Capacitor)
C109  value 2uF  [C1206]  (hidden comment: Capacitor)
C110  value 0.1uF  [C1206]  (hidden comment: Capacitor)
C111  value 0.1uF  [C1206]  (hidden comment: Capacitor)
C112  value 0.1uF  [C1206]  (hidden comment: Capacitor)
C121  value 10uF  [C1206]  (hidden comment: Capacitor)
C123  value 5.6uF  [C1206]  (hidden comment: Capacitor)
C124  value 5.6uF  [C1206]  (hidden comment: Capacitor)
C129  value 0.1uF  [C1206]  (hidden comment: Capacitor)
D100  RSX205LAM30TR  [SODFL4725X105N]  (value not drawn)
D101  RSX205LAM30TR  [SODFL4725X105N]  (value not drawn)
D104  RSX205LAM30TR  [SODFL4725X105N]  (value not drawn)
D106  RSX205LAM30TR  [SODFL4725X105N]  (value not drawn)
P100  Header 2  [HDR1X2]
P101  Header 2  [HDR1X2]
P102  Header 3  [HDR1X3]  (value not drawn)
R100  3k2  [R1206]
R101  10k  [R1206]
R102  10k  [R1206]
R103  1k  [R1206]
R104  500  [R1206]
R105  4k7  [R1206]
R106  15k  [R1206]
R107  10k  [R1206]
R108  10k  [R1206]
R109  500  [R1206]
R110  200k  [R1206]
R111  2k  [R1206]
R112  10k  [R1206]
R119  200k  [R1206]
R120  200k  [R1206]
R124  10k  [R1206]
TP100  V_Hist  [TestPoint Keystone 5000 Silver-Red]
TP101  Vout_osc_HF  [TestPoint Keystone 5000 Silver-Red]
TP102  GND  [TestPoint Keystone 5000 Silver-Red]
TP103  Vi_Feed  [TestPoint Keystone 5000 Silver-Red]
TP104  BHB  [TestPoint Keystone 5000 Silver-Red]
TP105  AHB  [TestPoint Keystone 5000 Silver-Red]
TP106  Vi_Error  [TestPoint Keystone 5000 Silver-Red]
TP107  +2.6V  [TestPoint Keystone 5000 Silver-Red]
TP108  BHS  [TestPoint Keystone 5000 Silver-Red]
TP109  BHI/ALI  [TestPoint Keystone 5000 Silver-Red]
TP110  BLI/AHI  [TestPoint Keystone 5000 Silver-Red]
TP111  AHS  [TestPoint Keystone 5000 Silver-Red]
U100  MCP664  [SOIC14]  (parts A,B,C,D of 4)
U101  SN74LVC3G06DCUT  [SOP50P310X90-8N]  (value not drawn)  (parts A,B,C of 3)
U102  HIP4081A  [SOIC20]
VR100  value 1k  [3299Y1203LF]  (hidden comment: Trimmer (Thru-Hole))
VR101  value 1k  [3299Y1203LF]  (hidden comment: Trimmer (Thru-Hole))

### Sub-sheets
U_Puente H = Puente H.SchDoc: Vi_Feed (out), BHO (in), BLO (in), AHO (in), ALO (in), BHS (out), AHS (out)

### Ports
Vi_Feed (out), Vi_Ref

### Nets
+2.5V: R111.2 VR101.1(CCW) VR101.2(W)
+2.6V: C101.2 C102.2 R100.2 TP107.1 VR100.2(W)
+5V: C104.2 C129.2 U100.4(V+) U101.8(Vcc) VR100.1(CCW)
+12V: C107.2 C108.2 C109.2 C110.2 C111.2 C112.2 C121.2 D100.2(A) D101.2(A) D104.1(K) P102.3 U102.15(VCC) U102.16(VDD)
GND: C101.1 C102.1 C103.2 C104.1 C107.1 C108.1 C109.1 C110.1 C111.1 C112.1 C129.1 D106.2(A) R103.1 R105.1 R119.2 R120.2 R124.1 TP102.1 U100.11(V-) U101.4(GND) U102.4(VSS) U102.14(ALS) U102.17(BLS)
AHB: C123.2 C124.2 D101.1(K) TP105.1 U102.10(AHB)
AHO: U102.11(AHO) ; sheet U_Puente H/AHO
AHS: C123.1 C124.1 TP111.1 U102.12(AHS) ; sheet U_Puente H/AHS
ALO: U102.13(ALO) ; sheet U_Puente H/ALO
BHB: C105.2 C106.2 D100.1(K) TP104.1 U102.1(BHB)
BHI/ALI: TP109.1 U101.3(2A) U101.7(1Y) U102.2(BHI) U102.6(ALI)
BHO: U102.20(BHO) ; sheet U_Puente H/BHO
BHS: C105.1 C106.1 TP108.1 U102.19(BHS) ; sheet U_Puente H/BHS
BLI/AHI: TP110.1 U101.5(2Y) U102.5(BLI) U102.7(AHI)
BLO: U102.18(BLO) ; sheet U_Puente H/BLO
DISABLE: C121.1 D104.2(A) D106.1(K) P102.2 R124.2 U102.3(DIS)
HDEL: R119.1 U102.8(HDEL)
LDEL: R120.1 U102.9(LDEL)
V_Hist: P100.1 R110.2 TP100.1 U100.7(OUT)
Vi_ Error: R104.1 R108.2 TP106.1 U100.1(OUT)
Vi_Feed: R107.1 TP103.1 ; port Vi_Feed, sheet U_Puente H/Vi_Feed
Vi_Ref: R102.1 ; port Vi_Ref
Vin_osc_HF: P100.2 R106.1
Vout_osc_HF: P101.1 R101.2 R112.2 TP101.1 U100.8(OUT)
Vsw: P101.2 U101.1(1A)
NetC103_1: C103.1 R101.1 R106.2 U100.9(IN-)
NetR100_1: R100.1 R102.2 R105.2 U100.3(IN+)
NetR103_2: R103.2 VR100.3(CW)
NetR104_2: R104.2 U100.6(IN-)
NetR107_2: R107.2 R108.1 U100.2(IN-)
NetR109_1: R109.1 R110.1 U100.5(IN+)
NetR109_2: R109.2 VR101.3(CW)
NetR111_1: R111.1 R112.1 U100.10(IN+)

Not connected (* = marked no-connect by the designer): P102 1*; U100 12(IN+)* 13(IN-)* 14(OUT)*; U101 2(3Y)* 6(3A)*

### Notes on the sheet
- (near R101) Fsw=50 kHz
- Controlador de corriente
- Ignacio Islas
- Javier Mosconi
- Juan Manuel Guariste
- 2.0

### Library data of the parts
C101 = Capacitor: CAP CER 1UF 25V X7R 1206; Mfr PN: GMC31X7R105M25NT; Manufacturer: CAL-CHIP ELECTRONICS, INC.; Supplier 1: Digi-Key; Supplier 1 PN: 2571-GMC31X7R105M25NTTR-ND
C102 C104 C129 = Capacitor: as C301 on sheet Compensador; Supplier 1: Digi-Key; Supplier 1 PN: 2679-C1206X7R500-104KNETR-ND
C103 = Capacitor: CAP CER 910PF 50V NP0 1206; Mfr PN: C1206C911J5GAC7800; Manufacturer: KEMET; Supplier 1 PN: 399-14715-1-ND; Supplier 1: Digi-Key
C105 C106 C123 C124 = Capacitor: CAP CER 4.7UF 50V X7R 1206; Manufacturer: Samsung Electro-Mechanics; Mfr PN: CL31B475KBHNFNE; Supplier 1: Digi-Key; Supplier 1 PN: 1276-3179-1-ND
C107-C109 = Capacitor: CAP1206 X5R 2.2UF 20% 35V; Mfr PN: GMC31X5R225M35NT; Manufacturer: CAL-CHIP ELECTRONICS, INC.; Supplier 1: Digi-Key; Supplier 1 PN: 2571-GMC31X5R225M35NTTR-ND
C110-C112 = Capacitor: as C505 on sheet Estimador; Supplier 1: Digi-Key; Supplier 1 PN: 2679-C1206X7R500-104KNETR-ND
C121 = Capacitor: CAP CER 10UF 16V X7R 1206; Manufacturer: CAL-CHIP ELECTRONICS, INC.; Mfr PN: GMC31X7R106M16NT; Supplier 1: Digi-Key; Supplier 1 PN: 2571-GMC31X7R106M16NTTR-ND
D100 D101 D104 D106 = RSX205LAM30TR: DIODE SCHOTTKY 30V 2A PMDTM; Manufacture: ROHM Semiconductor; Datasheet Link: https://fscdn.rohm.com/en/products/databook/datasheet/discrete/diode/schottky_barrier/rsx205lam30tr-e.pdf; Supplier 1 PN: RSX205LAM30CT-ND; Mfr PN: RSX205LAM30TR; Supplier 1: Digi-Key
P100 P101 = Header 2: as P500 on sheet Estimador; Link: https://www.digikey.com/en/products/detail/te-connectivity-amp-connectors/282834-2/1150135; Supplier 1: Digi-Key; Supplier 1 PN: A98333-ND
  P101: LatestRevisionDate: 17-Jul-2002
P102 = Header 3: as P1 on sheet Principal; Link: https://www.digikey.com/en/products/detail/te-connectivity-amp-connectors/282834-3/1153264; Supplier 1 PN: A98334-ND; Supplier 1: Digi-Key
R100 = R1206: RES 3.2K OHM 1% 1/4W 1206; Manufacturer: KOA Speer Electronics, Inc.; Mfr PN: RN73H2BTTD3201F25; PackageReference: 1206; Supplier 1: Digi-Key; Value: 3k2; Tolerance: 1%; Supplier 1 PN: 2019-RN73H2BTTD3201F25CT-ND
R101 R102 R107 R108 R112 R124 = R1206: as R319 on sheet Compensador; PackageReference: 1206; Supplier 1: Digi-Key; Value: 10k; Tolerance: 1%; Supplier 1 PN: 311-10.0KFRCT-ND
R103 = R1206: as R513 on sheet Estimador; Supplier 1 PN: RMCF1206FT1K00CT-ND; Supplier 1: Digi-Key; Value: 1k; Tolerance: 1%
R104 R109 = R1206: RES SMD 500 OHM 0.1% 0.3W 1206; Manufacturer: Vishay Foil Resistors (Division of Vishay Precision Group); Mfr PN: Y1625500R000B9W; PackageReference: 1206; Supplier 1: Digi-Key; Value: 500; Tolerance: 0.1%; Supplier 1 PN: Y1625500R000B9W-ND
R105 = R1206: RES 4.7K OHM 1% 1/4W 1206; Manufacturer: Stackpole Electronics Inc; Mfr PN: RMCF1206FT4K70; PackageReference: 1206; Supplier 1: Digi-Key; Value: 4k7; Tolerance: 1%; Supplier 1 PN: RMCF1206FT4K70CT-ND
R106 = R1206: RES 15K OHM 1% 1/4W 1206; Manufacturer: Vishay Dale; Mfr PN: CRCW120615K0FKEAC; PackageReference: 1206; Supplier 1: Digi-Key; Value: 15k; Tolerance: 1%; Supplier 1 PN: 541-CRCW120615K0FKEACCT-ND
R110 R119 R120 = R1206: as R312 on sheet Compensador; PackageReference: 1206; Supplier 1: Digi-Key; Value: 200k; Tolerance: 1%; Supplier 1 PN: 311-200KFRCT-ND
R111 = R1206: RES 2K OHM 1% 1/4W 1206; Manufacturer: Stackpole Electronics Inc; Mfr PN: RMCF1206FT2K00; PackageReference: 1206; Supplier 1: Digi-Key; Value: 2k; Tolerance: 1%; Supplier 1 PN: RMCF1206FT2K00CT-ND
TP100-TP111 = Testpoint: as TP500 on sheet Estimador; Link: https://www.digikey.com/en/products/detail/keystone-electronics/5000/255326; Supplier 1 PN: 36-5000-ND; Supplier 1: Digi-Key
U100 = MCP664: as U500 on sheet Estimador; Datasheet: https://ar.mouser.com/datasheet/2/268/20002194E-2448650.pdf; Supplier 1: Digi-Key; Supplier 1 PN: MCP664-E/ST-ND
U101 = SN74LVC3G06DCUT: IC INVERTER OD 3CH 3-INP 8VSSOP; Manufacturer: Texas Instruments; Datasheet Link: http://www.ti.com/lit/gpn/SN74LVC3G06; Mfr PN: SN74LVC3G06DCUT; Supplier 1 PN: 296-46211-1-ND; Supplier 1: Digi-Key
U102 = HIP4081A: IC GATE DRVR HALF-BRIDGE 20SOIC; Mfr PN: HIP4081AIBZ; Manufacturer: Renesas Electronics America Inc; Datasheet: https://www.mouser.jp/datasheet/2/698/hip4081a-1528771.pdf; Supplier 1 PN: HIP4081AIBZ-ND; Supplier 1: Digi-Key
VR100 = Trimmer: e; Mfr PN: 3299Y-1-102LF; Manufacturer: Bourns Inc.; Supplier 1: Digi-Key; Supplier 1 PN: 3299Y-102LF-ND
VR101 = Trimmer: TRIMMER 1K OHM 0.5W PC PIN TOP; Mfr PN: 3299Y-1-102LF; Manufacturer: Bourns Inc.; Supplier 1: Digi-Key; Supplier 1 PN: 3299Y-102LF-ND

## Sheet Puente H.SchDoc
size A4; DocumentNumber: 3; SheetNumber: 3; SheetTotal: 7
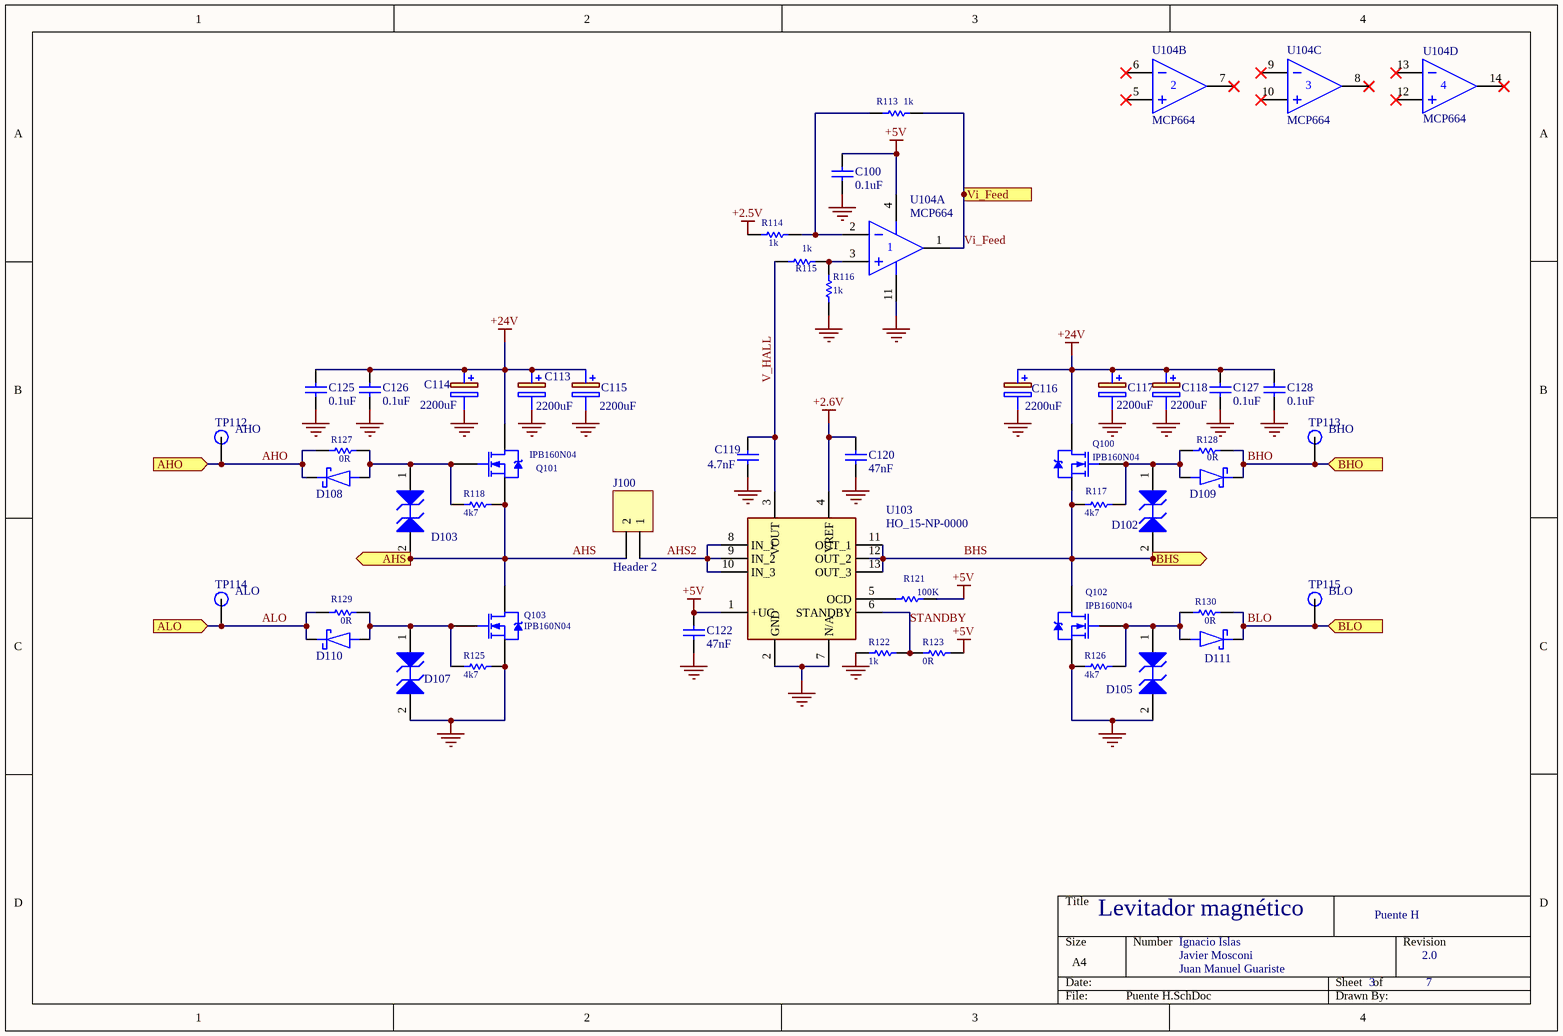
[diagram p6: Puente H.SchDoc]

### Parts
C100  value 0.1uF  [C1206]  (hidden comment: Capacitor)
C113  value 2200uF  [CAPPRD500W60D1300H2650]  (hidden comment: EKY-350ELL102MK25S)
C114  value 2200uF  [CAPPRD500W60D1300H2650]  (hidden comment: EKY-350ELL102MK25S)
C115  value 2200uF  [CAPPRD500W60D1300H2650]  (hidden comment: EKY-350ELL102MK25S)
C116  value 2200uF  [CAPPRD500W60D1300H2650]  (hidden comment: EKY-350ELL102MK25S)
C117  value 2200uF  [CAPPRD500W60D1300H2650]  (hidden comment: EKY-350ELL102MK25S)
C118  value 2200uF  [CAPPRD500W60D1300H2650]  (hidden comment: EKY-350ELL102MK25S)
C119  value 4.7nF  [C1206]  (hidden comment: Capacitor)
C120  value 47nF  [C1206]  (hidden comment: Capacitor)
C122  value 47nF  [C1206]  (hidden comment: Capacitor)
C125  value 0.1uF  [C1206]  (hidden comment: Capacitor)
C126  value 0.1uF  [C1206]  (hidden comment: Capacitor)
C127  value 0.1uF  [C1206]  (hidden comment: Capacitor)
C128  value 0.1uF  [C1206]  (hidden comment: Capacitor)
D102  SMAJ15A  [ONSC-SMA-2-403D-02_F_V]  (value not drawn)
D103  SMAJ15A  [ONSC-SMA-2-403D-02_F_V]  (value not drawn)
D105  SMAJ15A  [ONSC-SMA-2-403D-02_F_V]  (value not drawn)
D107  SMAJ15A  [ONSC-SMA-2-403D-02_F_V]  (value not drawn)
D108  RSX205LAM30TR  [SODFL4725X105N]  (value not drawn)
D109  RSX205LAM30TR  [SODFL4725X105N]  (value not drawn)
D110  RSX205LAM30TR  [SODFL4725X105N]  (value not drawn)
D111  RSX205LAM30TR  [SODFL4725X105N]  (value not drawn)
J100  Header 2  [SMKDS5-2-9.5]
Q100  IPB160N04  [TO263-7S]
Q101  IPB160N04  [TO263-7S]
Q102  IPB160N04  [TO263-7S]
Q103  IPB160N04  [TO263-7S]
R113  1k  [R1206]
R114  1k  [R1206]
R115  1k  [R1206]
R116  1k  [R1206]
R117  4k7  [R1206]
R118  4k7  [R1206]
R121  100K  [R1206]
R122  1k  [R1206]
R123  0R  [R1206]
R125  4k7  [R1206]
R126  4k7  [R1206]
R127  0R  [R1206]
R128  0R  [R1206]
R129  0R  [R1206]
R130  0R  [R1206]
TP112  AHO  [TestPoint Keystone 5000 Silver-Red]
TP113  BHO  [TestPoint Keystone 5000 Silver-Red]
TP114  ALO  [TestPoint Keystone 5000 Silver-Red]
TP115  BLO  [TestPoint Keystone 5000 Silver-Red]
U103  HO_15-NP-0000  [HO15NP0000]
U104  MCP664  [SOIC14]  (parts A,B,C,D of 4)

### Ports
AHO (in), AHS (out), ALO (in), BHO (in), BHS (out), BLO (in), Vi_Feed (out)

### Nets
+2.5V: R114.1
+2.6V: C120.1 U103.4(VREF)
+5V: C100.1 C122.2 R121.2 R123.1 U103.1(+UC) U104.4(V+)
+24V: C113.1(+) C114.1(+) C115.1(+) C116.1(+) C117.1(+) C118.1(+) C125.2 C126.2 C127.2 C128.2 Q100.4(D) Q101.4(D)
GND: C100.2 C113.2(-) C114.2(-) C115.2(-) C116.2(-) C117.2(-) C118.2(-) C119.1 C120.2 C122.1 C125.1 C126.1 C127.1 C128.1 D105.2(A2) D107.2(A2) Q102.2(S) Q102.3(S) Q102.5(S) Q102.6(S) Q102.7(S) Q103.2(S) Q103.3(S) Q103.5(S) Q103.6(S) Q103.7(S) R116.1 R122.2 R125.2 R126.1 U103.2(GND) U103.7(N/A) U104.11(V-)
AHO: D108.1(K) R127.1 TP112.1 ; port AHO
AHS: D103.2(A2) J100.2 Q101.2(S) Q101.3(S) Q101.5(S) Q101.6(S) Q101.7(S) Q103.4(D) R118.2 ; port AHS
AHS2: J100.1 U103.8(IN_1) U103.9(IN_2) U103.10(IN_3)
ALO: D110.1(K) R129.1 TP114.1 ; port ALO
BHO: D109.1(K) R128.2 TP113.1 ; port BHO
BHS: D102.2(A2) Q100.2(S) Q100.3(S) Q100.5(S) Q100.6(S) Q100.7(S) Q102.4(D) R117.1 U103.11(OUT_1) U103.12(OUT_2) U103.13(OUT_3) ; port BHS
BLO: D111.1(K) R130.2 TP115.1 ; port BLO
STANDBY: R122.1 R123.2 U103.6(STANDBY)
V_HALL: C119.2 R115.1 U103.3(VOUT)
Vi_Feed: R113.2 U104.1(OUT) ; port Vi_Feed
NetD102_1: D102.1(A1) D109.2(A) Q100.1(G) R117.2 R128.1
NetD103_1: D103.1(A1) D108.2(A) Q101.1(G) R118.1 R127.2
NetD105_1: D105.1(A1) D111.2(A) Q102.1(G) R126.2 R130.1
NetD107_1: D107.1(A1) D110.2(A) Q103.1(G) R125.1 R129.2
NetR113_1: R113.1 R114.2 U104.2(IN-)
NetR115_2: R115.2 R116.2 U104.3(IN+)
NetR121_1: R121.1 U103.5(OCD)

Not connected (* = marked no-connect by the designer): U104 5(IN+)* 6(IN-)* 7(OUT)* 8(OUT)* 9(IN-)* 10(IN+)* 12(IN+)* 13(IN-)* 14(OUT)*

### Notes on the sheet
- Levitador magnético
- Puente H
- Ignacio Islas
- Javier Mosconi
- Juan Manuel Guariste
- 2.0

### Library data of the parts
C100 C125-C128 = Capacitor: as C301 on sheet Compensador; Supplier 1: Digi-Key; Supplier 1 PN: 2679-C1206X7R500-104KNETR-ND
C113-C118 = EKY-350ELL102MK25S: CAP ALUM 2200UF 20% 35V RADIAL; Manufacturer: United Chemi-Con; Mfr PN: EKY-350ELL222MM25S; Datasheet Link: https://www.digikey.com/en/products/detail/united-chemi-con/EKY-350ELL222MM25S/756106; Supplier 1 PN: 565-1590-ND; Supplier 1: Digi-Key
C119 = Capacitor: CAP CER 4700PF 200V X7R 1206; Manufacturer: CAL-CHIP ELECTRONICS, INC.; Mfr PN: GMC31X7R472K200NT; Ssupplier 1: Digi-Key; Supplier 1 PN: 2571-GMC31X7R472K200NTTR-ND
C120 C122 = Capacitor: CAP CER 0.047UF 50V C0G/NP0 1206; Manufacturer: CAL-CHIP ELECTRONICS, INC.; Mfr PN: GMC31CG473J50NT; Supplier 1: Digi-Key; Supplier 1 PN: 2571-GMC31CG473J50NTTR-ND
D102 D103 D105 D107 = 1SMA60CAT3G: TVS DIODE 18VWM 29.2VC DO214AC; Mfr PN: SMAJ18A; Manufacturer: Littelfuse Inc.; Supplier 1: Digi-Key; Supplier 1 PN: SMAJ18ALFCT-ND; ComponentLink1Description: Manufacturer URL; ComponentLink1URL: http://www.onsemi.com/; ComponentLink2Description: Datasheet; ComponentLink2URL: http://www.onsemi.com/pub_link/Collateral/1SMA10CAT3-D.PDF; ComponentLink3Description: Package Specification; ComponentLink3URL: http://www.onsemi.com/pub_link/Collateral/1SMA5913BT3-D.PDF
D108-D111 = RSX205LAM30TR: as D500 on sheet Estimador; Datasheet Link: https://fscdn.rohm.com/en/products/databook/datasheet/discrete/diode/schottky_barrier/rsx205lam30tr-e.pdf; Supplier 1 PN: 1.05mm; Mfr PN: RSX205LAM30TR; Supplier 1: RSX205LAM30CT-ND
J100 = Header 2: TERM BLK 2P SIDE ENT 2.54MM PCB; Mfr PN: 282834-2; Manufacturer: TE Connectivity AMP Connectors; Supplier 1: Digi-Key; Link: https://www.digikey.com/en/products/detail/te-connectivity-amp-connectors/282834-2/1150135; Supplier 1 PN: A98333-ND
Q100-Q103 = IPB160N04: MOSFET N-CH 40V 160A TO263-7; Mfr PN: IPB160N04S3H2ATMA1; Manufacturer: Infineon Technologies; Datasheet: https://www.infineon.com/dgdl/Infineon-IPB160N04S3_H2-DS-v01_00-en.pdf?fileId=db3a304412b407950112b42b8da04548&ack=t; Supplier 1: Digi-Key; Supplier 1 PN: IPB160N04S3H2ATMA1CT-ND
R113-R116 R122 = R1206: as R301 on sheet Compensador; PackageReference: 1206; Supplier 1: Digi-Key; Value: 1k; Tolerance: 1%; Supplier 1 PN: RMCF1206FT1K00CT-ND
R117 R118 R125 R126 = R1206: as R202 on sheet Fuentes; Supplier 1 PN: RMCF1206FT4K70CT-ND; PackageReference: 1206; Supplier 1: Digi-Key; Value: 4k7; Tolerance: 1%
R121 = R1206: as R502 on sheet Estimador; PackageReference: 1206; Supplier 1: Digi-Key; Value: 100K; Tolerance: 1%; Supplier 1 PN: RMCF1206FT100KCT-ND
R123 R127-R130 = R1206: RES 0 OHM JUMPER 1/4W 1206; Manufacturer: Stackpole Electronics Inc; Mfr PN: RMCF1206ZT0R00; PackageReference: 1206; Supplier 1: Digi-Key; Value: 0R; Supplier 1 PN: RMCF1206ZT0R00CT-ND
TP112-TP115 = Testpoint: as TP500 on sheet Estimador; Link: https://www.digikey.com/en/products/detail/keystone-electronics/5000/255326; Supplier 1 PN: 36-5000-ND; Supplier 1: Digi-Key
U103 = HO_15-NP-0000: SENSOR CURRENT HALL 15A AC/DC; Mfr PN: HO 15-NP-0000; Manufacturer: LEM USA Inc.; Datasheet Link: http://www.farnell.com/datasheets/2150001.pdf; Supplier 1 PN: 398-1142-ND; Supplier 1: Digi-Key
U104 = MCP664: IC OPAMP GP 4 CIRCUIT 14TSSOP; Part Number: MCP664-E/ST; Manufacturer: Microchip Technology; Datasheet: https://ar.mouser.com/datasheet/2/268/20002194E-2448650.pdf; Supplier 1: Digi-Key; Supplier 1 PN: MCP664-E/ST-ND

## Nets that join several sheets
+2.5V: Estimador (R512.2 R514.1 U501.3), Compensador (7 pins), Fuentes (C206.2 TP200.1 VR202.5 VR202.6), Interfaz digital (J400.2 R408.2 R412.1), Controlador de corriente (R111.2 VR101.1 VR101.2), Puente H (R114.1)
+2.6V: Controlador de corriente (5 pins), Puente H (C120.1 U103.4)
+5V: Principal (R1.2), Estimador (5 pins), Compensador (C301.2 C302.2 U300.4 U301.4), Fuentes (6 pins), Interfaz digital (C405.1 C410.1 U400.4 U401.4), Controlador de corriente (5 pins), Puente H (6 pins)
+12V: Fuentes (6 pins), Controlador de corriente (13 pins)
+24V: Fuentes (D203.1 F200.1 J200.1), Puente H (12 pins)
GND: Principal (R3.1), Estimador (8 pins), Compensador (8 pins), Fuentes (16 pins), Interfaz digital (19 pins), Controlador de corriente (23 pins), Puente H (33 pins)
AHO: Controlador de corriente (U102.11), Puente H (D108.1 R127.1 TP112.1)
AHS: Controlador de corriente (C123.1 C124.1 TP111.1 U102.12), Puente H (9 pins)
ALO: Controlador de corriente (U102.13), Puente H (D110.1 R129.1 TP114.1)
BHO: Controlador de corriente (U102.20), Puente H (D109.1 R128.2 TP113.1)
BHS: Controlador de corriente (C105.1 C106.1 TP108.1 U102.19), Puente H (11 pins)
BLO: Controlador de corriente (U102.18), Puente H (D111.1 R130.2 TP115.1)
Vcomp_A: Principal (P1.1), Compensador (R323.2 TP302.1 U301.8)
Vcomp_D: Principal (P1.3), Interfaz digital (C400.1 R402.2 TP400.1 U401.1)
Vi_Feed: Estimador (R508.1), Interfaz digital (C406.1 U400.3), Controlador de corriente (R107.1 TP103.1), Puente H (R113.2 U104.1)
Vi_Ref: Principal (P1.2), Controlador de corriente (R102.1)
Vpos_Est: Principal (P2.2), Compensador (R303.1 R304.1)
Vpos_Est_A: Principal (P2.1), Estimador (C500.1 R503.1 TP500.1 U501.14)
Vpos_Est_D: Principal (P2.3), Interfaz digital (C403.1 R407.2 TP401.1 U401.7)
Vpos_Ref: Principal (R2.2 R2.3 R3.2), Compensador (U300.10), Interfaz digital (R413.1)